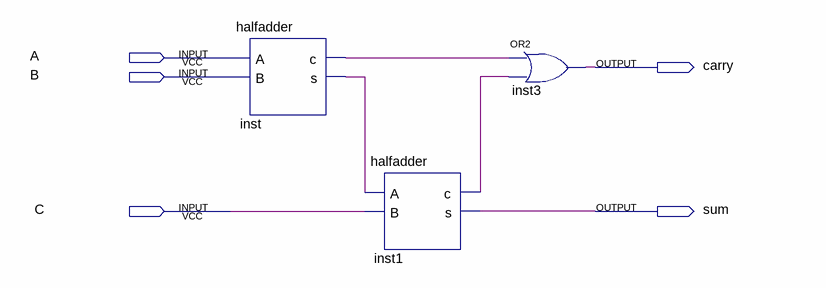
[diagram p0: schematic sheet]
// Quartus schematic fulladder.bdf as structural Verilog: 3 symbols, 5 pins
module fulladder (
  input  A,
  input  B,
  input  C,
  output carry,
  output sum
);

  wire inst1_c, inst_c, inst_s;

  halfadder inst (.A(A), .B(B), .c(inst_c), .s(inst_s));
  halfadder inst1 (.A(inst_s), .B(C), .c(inst1_c), .s(sum));
  or inst3 (carry, inst_c, inst1_c);
endmodule
